# Altium schematic sheet P1.schdoc
size 839 x 594 mm; Symbol: Drawing-Symbol_A4; Company: 嘉立创EDA; Version: V1.0; Page Size: A4; @Project Name: Matrix_PassThrough; @Update Date: 2026-05-08; @Create Date: 2026-05-08; Device: Drawing-Symbol_A4; @Board Name: Board1; @Page Name: P1; @Create Time: 22:34:33; @Page Count: 1; @Page No: 1; @Schematic Name: Schematic1; @Update Time: 22:34:33; @Assembly Variant: Basic; Border: 1; Title Block Position: 3; Size: A4; Width: 3304; Height: 2338; Region Start: 1; X Region Count: 6; Y Region Count: 4; Blade Width: 10; Title Block: 1
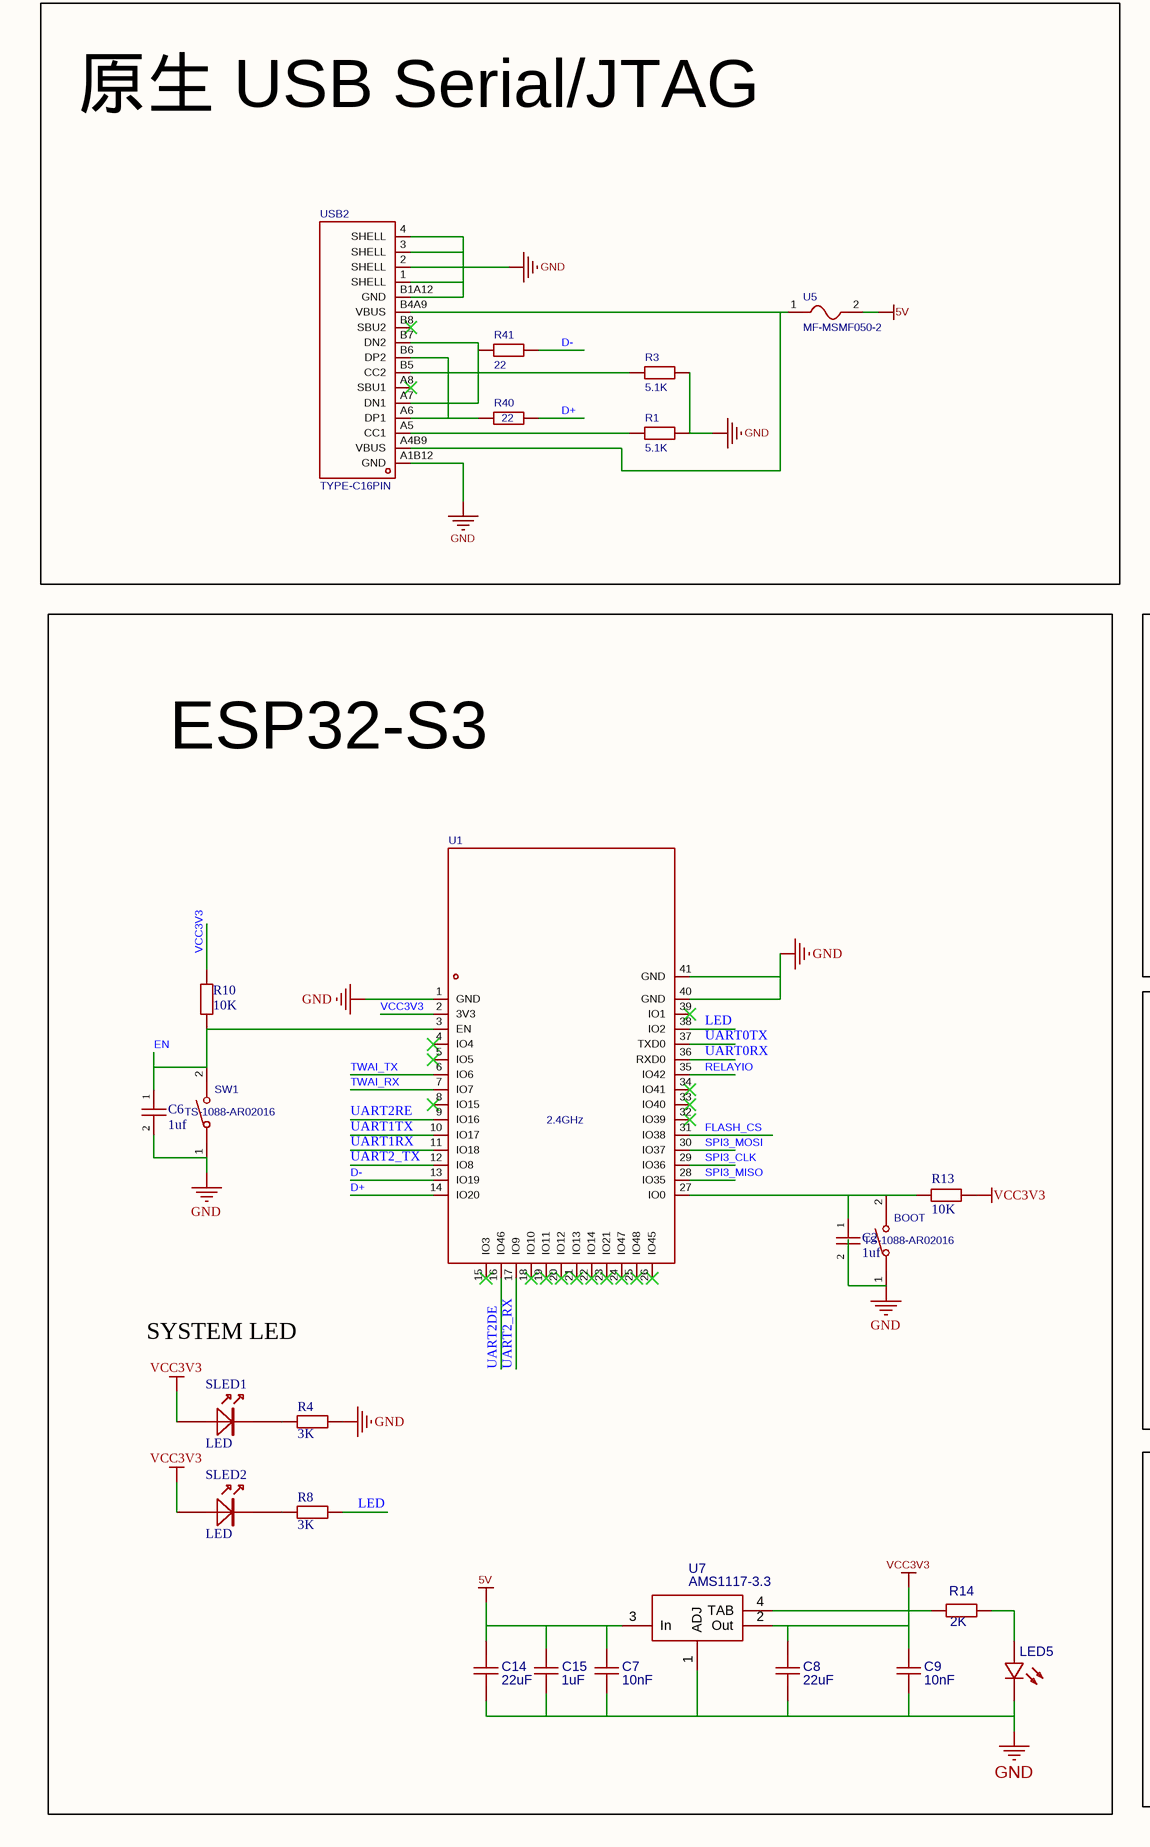
[diagram p0: P1.schdoc, left]
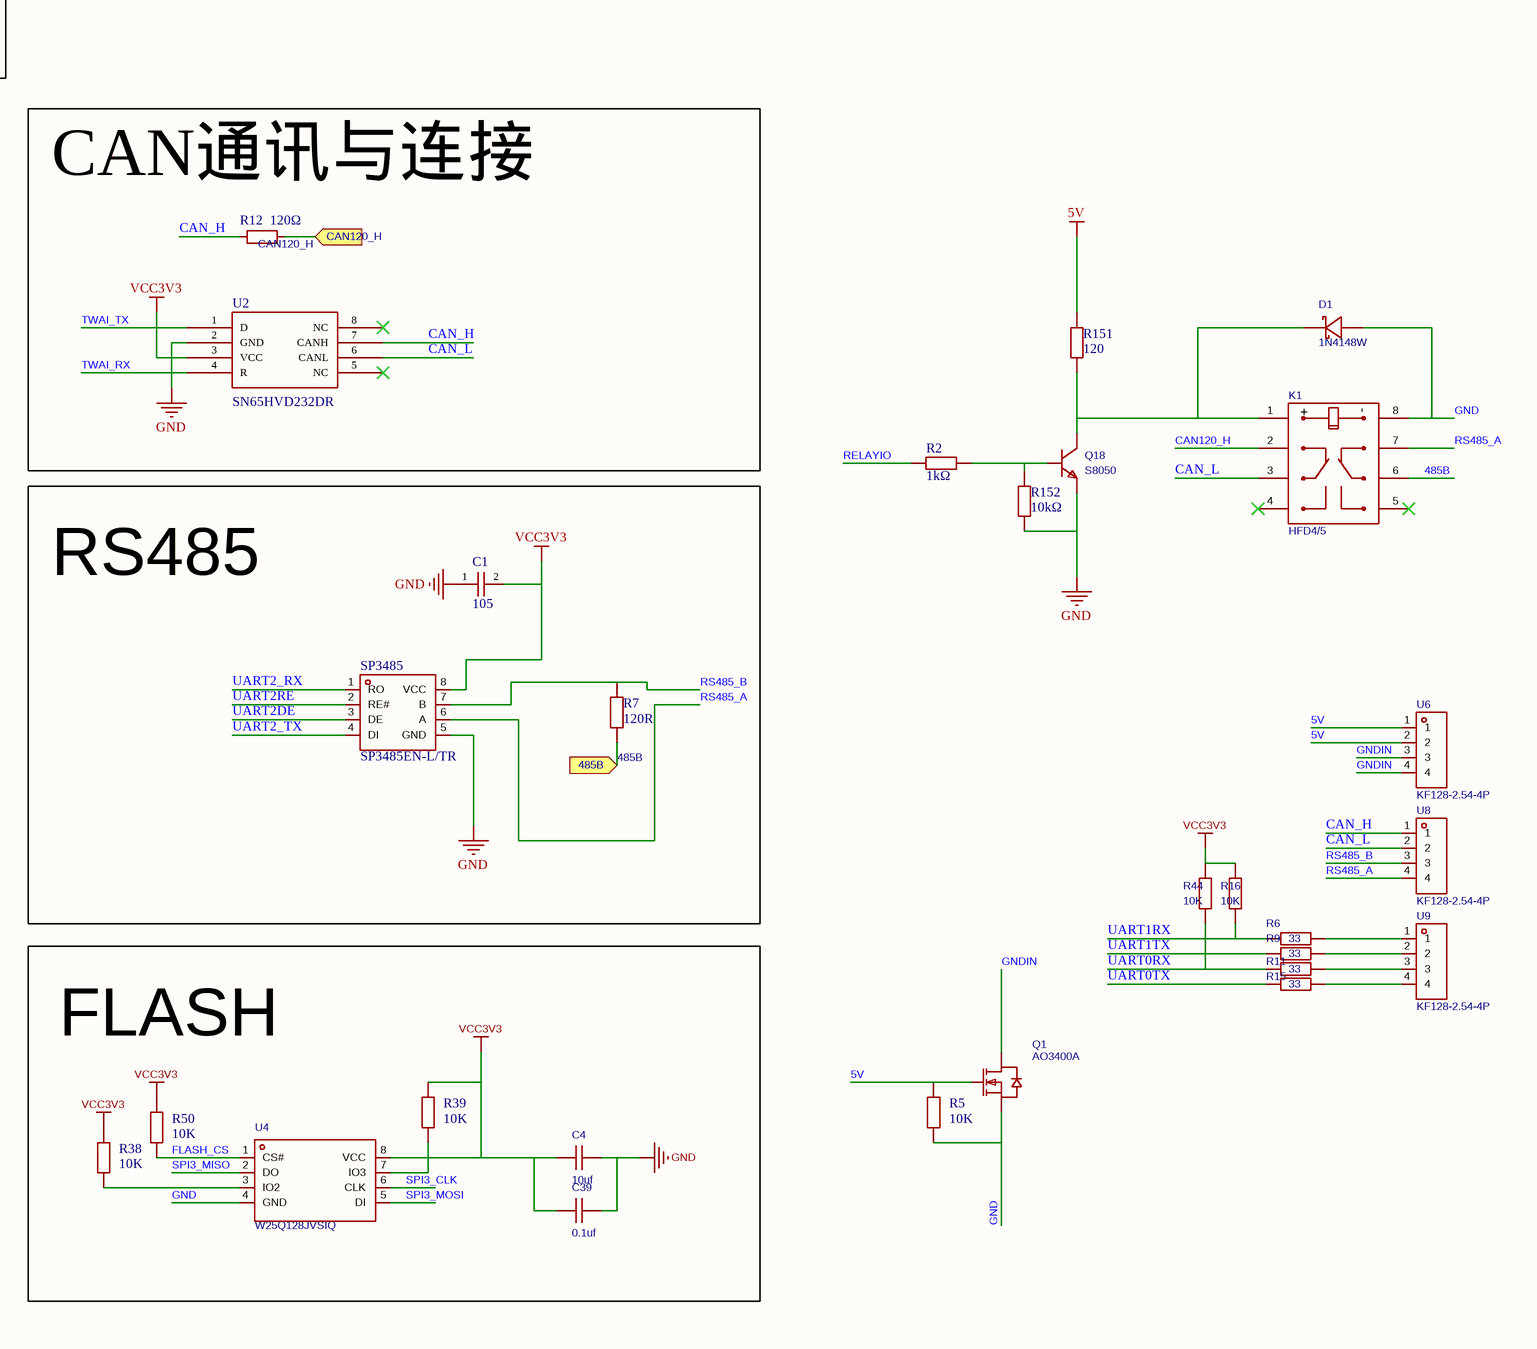
[diagram p1: P1.schdoc, right]

## Parts
BOOT  TS-1088-AR02016  [SW-SMD_L3.9-W3.0-P4.45]
C1  105  [0805_107]
C2  1uf  [0805R_107]
C4  10uf  [C0805]
C6  1uf  [0805R_107]
C7  10nF  [C0603]
C8  22uF  [22uFC1206]
C9  10nF  [C0603]
C14  22uF  [22uFC1206]
C15  1uF  [C0603]
C39  0.1uf  [C0805]
D1  1N4148W  [SOD-123_L2.7-W1.6-LS3.7-FD]
K1  HFD4/5  [RELAY-TH_HFDXXX]
LED5  FC-DA1608HRK-620D  [LED0805-FD_GL0805UG01]  (value not drawn)
Q1  AO3400A  [SOT-23-3_L2.9-W1.3-P1.90-LS2.4-BR]
Q18  S8050  [SOT-23-3_L2.9-W1.6-P1.90-LS2.8-BR]
R1  5.1K  [R0603]
R2  1kΩ  [R0805]
R3  5.1K  [R0603]
R4  3K  [0805_107]
R5  10K  [0805_107]
R6  33  [R0603]
R7  120R  [0805_107]
R8  3K  [0805_107]
R9  33  [R0603]
R10  10K  [0805_107]
R11  33  [R0603]
R12  120Ω  [R0805]
R13  10K  [0805_107]
R14  2K  [R0603]
R15  33  [R0603]
R16  10K  [R0603]
R38  10K  [0805_107]
R39  10K  [0805_107]
R40  22  [R0603]
R41  22  [R0603]
R44  10K  [R0603]
R50  10K  [0805_107]
R151  120  [R0805]
R152  10kΩ  [R0805]
SLED1  LED  [LED0805-RD_GREEN-1]
SLED2  LED  [LED0805-RD_GREEN-1]
SP3485  SP3485EN-L/TR  [SO-8_L4.9-W3.9-P1.27-LS6.0-BL]
SW1  TS-1088-AR02016  [SW-SMD_L3.9-W3.0-P4.45]
U1  2.4GHz  [WIRELM-SMD_ESP32-S3-WROOM-1]
U2  Manufacturer Part Number: SN65HVD232DR  [SO-8]  (hidden comment: SN65HVD232D)
U4  W25Q128JVSIQ  [SOIC-8_L5.3-W5.3-P1.27-LS8.0-BL]
U5  MF-MSMF050-2  [F1812]
U6  KF128-2.54-4P  [CONN-TH_4P-P2.54_KF128-2.54-4P]
U7  AMS1117-3.3  [ams1117]
U8  KF128-2.54-4P  [CONN-TH_4P-P2.54_KF128-2.54-4P]
U9  KF128-2.54-4P  [CONN-TH_4P-P2.54_KF128-2.54-4P]
USB2  TYPE-C16PIN  [USB-C-SMD_TYPE-C16PIN]

## Blocks framed on the sheet
原生 USB Serial/JTAG: R1 R3 R40 R41 U5 USB2
ESP32-S3: BOOT C2 C6-C9 C14 C15 LED5 R4 R8 R10 R13 R14 SLED1 SLED2 SW1 U1 U7
CAN通讯与连接: R12 U2
RS485: C1 R7 SP3485
FLASH: C4 C39 R38 R39 R50 U4

## Ports
485B (in), CAN120_H (in)

## Nets
5V: C7.2 C14.2 C15.2 Q1.1(G) R5.2 R151.2 U5.2 U6.1 U6.2 U7.3(In)
GND: BOOT.1 C1.1 C2.2 C4.2 C6.2 C7.1 C8.1 C9.1 C14.1 C15.1 C39.2 D1.1(A) K1.8 LED5.2(K) Q1.2(S) Q18.2 R1.2 R3.2 R4.2 R5.1 R152.1 SP3485.5(GND) SW1.1 U1.1(GND) U1.40(GND) U1.41(GND) U2.2(GND) U4.4(GND) U7.1(ADJ) USB2.1(SHELL) USB2.2(SHELL) USB2.3(SHELL) USB2.4(SHELL) USB2.A1B12(GND) USB2.B1A12(GND)
VCC3V3: C1.2 C4.1 C8.2 C9.2 C39.1 R10.2 R13.1 R14.1 R16.2 R38.2 R39.2 R44.2 R50.2 SLED1.1 SLED2.1 SP3485.8(VCC) U1.2(3V3) U2.3(VCC) U4.8(VCC) U7.2(Out) U7.4(TAB)
485B: K1.6 R7.1 ; port 485B
CAN120_H: K1.2 R12.2 ; port CAN120_H
CAN_H: R12.1 U2.7(CANH) U8.1
CAN_L: K1.3 U2.6(CANL) U8.2
D+: R40.2 U1.14(IO20)
D-: R41.2 U1.13(IO19)
EN: C6.1 R10.1 SW1.2 U1.3(EN)
FLASH_CS: R50.1 U1.31(IO38) U4.1(CS#)
GNDIN: Q1.3(D) U6.3 U6.4
LED: R8.2 U1.38(IO2)
RELAYIO: R2.1 U1.35(IO42)
RS485_A: K1.7 SP3485.6(A) U8.4
RS485_B: R7.2 SP3485.7(B) U8.3
SPI3_CLK: U1.29(IO36) U4.6(CLK)
SPI3_MISO: U1.28(IO35) U4.2(DO)
SPI3_MOSI: U1.30(IO37) U4.5(DI)
TWAI_RX: U1.7(IO7) U2.4(R)
TWAI_TX: U1.6(IO6) U2.1(D)
UART0RX: R11.2 R44.1 U1.36(RXD0)
UART0TX: R15.2 U1.37(TXD0)
UART1RX: R6.2 R16.1 U1.11(IO18)
UART1TX: R9.2 U1.10(IO17)
UART2_RX: SP3485.1(RO) U1.17(IO9)
UART2_TX: SP3485.4(DI) U1.12(IO8)
UART2DE: SP3485.3(DE) U1.16(IO46)
UART2RE: SP3485.2(RE#) U1.9(IO16)
NetBOOT_2: BOOT.2 C2.1 R13.2 U1.27(IO0)
NetD1_2: D1.2(K) K1.1 Q18.3 R151.1
NetLED5_1: LED5.1(A) R14.2
NetQ18_1: Q18.1 R2.2 R152.2
NetR1_1: R1.1 USB2.A5(CC1)
NetR3_1: R3.1 USB2.B5(CC2)
NetR4_1: R4.1 SLED1.2
NetR6_1: R6.1 U9.1
NetR8_1: R8.1 SLED2.2
NetR9_1: R9.1 U9.2
NetR11_1: R11.1 U9.3
NetR15_1: R15.1 U9.4
NetR38_1: R38.1 U4.3(IO2)
NetR39_1: R39.1 U4.7(IO3)
NetR40_1: R40.1 USB2.A6(DP1) USB2.B6(DP2)
NetR41_1: R41.1 USB2.A7(DN1) USB2.B7(DN2)
NetU5_1: U5.1 USB2.A4B9(VBUS) USB2.B4A9(VBUS)

Not connected (* = marked no-connect by the designer): K1 4* 5*; U1 4(IO4)* 5(IO5)* 8(IO15)* 15(IO3)* 18(IO10)* 19(IO11)* 20(IO12)* 21(IO13)* 22(IO14)* 23(IO21)* 24(IO47)* 25(IO48)* 26(IO45)* 32(IO39)* 33(IO40)* 34(IO41)* 39(IO1)*; U2 5(NC)* 8(NC)*; USB2 A8(SBU1)* B8(SBU2)*

## Notes on the sheet
- SYSTEM LED
- 创建日期
- 2026-05-08
- 原理图
- 板子
- Schematic1
- Board1
- 更新日期
- 图页
- P1
- 绘制
- 审阅
- Matrix_PassThrough
- 版本
- V1.0
- 尺寸
- A4
- 页    1    共    1
- 嘉立创EDA
- (in symbol HFD4/5) +; -

## Library data of the parts
BOOT SW1 = TS-1088-AR02016: 电路结构:单刀单掷;按钮形状:圆形按钮;作用力:1.6N;安装方式:立贴;开关长度:4mm;开关宽度:3mm;开关高度:2mm;带支架:不带支架;触点电流:50mA;额定电压:12V;工作寿命:10万次;; Manufacturer: XUNPU(讯普); 3D Model: b26698b69f274ffabef8a26c7d0e5dd10819f05c4eef4c71ace90d822a990e87; 3D Model Transform: 188.976,114.174,0,0,0,0,0,0,0; Circuit: 单刀单掷; Actuator Style: 圆形按钮; Operating Force: 1.6N; Switch Height: 2mm; with Bracket: 不带支架; Contact Current: 50mA; Voltage Rating: 12V; Actuator/Cap Color: 黑色; Life: 10万次; AddInBom: yes; ModelName: SW-SMD_L3.9-W2.9-H2.0-LS4.8; Symbol: TS-1088-AR02016; Device: TS-1088-AR02016; LCSC Part Name: 4*3*2mm 立贴 轻触开关; Supplier Part: C720477; Manufacturer Part: TS-1088-AR02016; Supplier Footprint: SMD,4x3mm; JLCPCB Part Class: Basic Part; Datasheet: https://item.szlcsc.com/datasheet/TS-1088-AR02016/763484.html; Supplier: LCSC; Mounting Type: 立贴; Length: 4mm; Width: 3mm; Termination Style: SMD接片; Operating Temperature: -30℃~+80℃; ConvertToPcb: yes; FootprintName: SW-SMD_L3.9-W3.0-P4.45
C1 = 105: Capacitor; Symbol: Cap; Origin Footprint: C 1210_L; Value: 104; AddInBom: yes; Device: 105; Design Item ID: Cap; Library Name: Matrix_Schlib; Published: 8-Jun-2000; LatestRevisionDate: 17-Jul-2002; LatestRevisionNote: Re-released for DXP Platform.; Publisher: Altium Limited; ConvertToPcb: yes
C2 C6 = 104: Capacitor; Symbol: Cap; Origin Footprint: C_0805; Value: 104; AddInBom: yes; Device: 104; Design Item ID: Cap; Library Name: Matrix_Schlib; Published: 8-Jun-2000; LatestRevisionDate: 17-Jul-2002; LatestRevisionNote: Re-released for DXP Platform.; Publisher: Altium Limited; ConvertToPcb: yes
C4 C39 = CL21B103KBANNNC: 容值:10nF;精度:±10%;额定电压:50V;温度系数:X7R;; Manufacturer: SAMSUNG(三星); 3D Model: 1ba041120af144c991958decab20d2410819f05c4eef4c71ace90d822a990e87; 3D Model Transform: 78.74,51.181,0,0,0,0,0,0.0005,0; Tolerance: ±10%; Voltage Rating: 50V; Temperature Coefficient: X7R; AddInBom: yes; ModelName: C0805_L2.0-W1.3-H1.3; Symbol: CL21B103KBANNNC; Device: CL21B103KBANNNC; LCSC Part Name: 10nF ±10% 50V; Manufacturer Part: CL21B103KBANNNC; Supplier Footprint: 0805; JLCPCB Part Class: Basic Part; Datasheet: https://item.szlcsc.com/datasheet/CL21B103KBANNNC/2062.html; Supplier: LCSC; ConvertToPcb: yes; FootprintName: C0805
  C4: Value: 10uf
  C39: Value: 0.1uf
C7 C9 = CC0603KRX7R9BB103: Manufacturer: YAGEO; Add into BOM: yes; 3D Model: fca5be93b99f4b5a9a2fd372d58c31d9; Symbol: 10nF; Device: CC0603KRX7R9BB103; Convert to PCB: yes; Supplier: LCSC; Manufacturer Part: CC0603KRX7R9BB103; FootprintName: C0603; ModelName: C0603
C8 C14 = GRM21BD70J226ME44L: Manufacturer: Murata Electronics; Add into BOM: yes; Origin Footprint: CAP_0805; Symbol: 22uF; Device: GRM21BD70J226ME44L; Convert to PCB: yes; Supplier: LCSC; Manufacturer Part: GRM21BD70J226ME44L
C15 = CL10A105KP8NNNC: Manufacturer: SAMSUNG; Add into BOM: yes; 3D Model: fca5be93b99f4b5a9a2fd372d58c31d9; Symbol: 1uF; Device: CL10A105KP8NNNC; Convert to PCB: yes; Supplier: LCSC; Manufacturer Part: CL10A105KP8NNNC; FootprintName: C0603; ModelName: C0603
D1 = 1N4148W_C7420318: 二极管配置:独立式;正向压降(Vf):1.25V@150mA;直流反向耐压(Vr):100V;整流电流:150mA;反向恢复时间(Trr):4ns;; Manufacturer: R+O(宏嘉诚); AddInBom: yes; ModelId: 5054d9b7be8b429dad093a54b517b4dd0819f05c4eef4c71ace90d822a990e87; ModelTransform: 145.669,61.024,0,0,0,0,0,0,0; Diode Configuration: 独立式; Voltage - DC Reverse(Vr): 100V; Current - Rectified: 150mA; Pd - Power Dissipation: 400mW; Reverse Leakage Current (Ir): 1uA@75V; Reverse Recovery Time (trr): 4ns; Operating Junction Temperature Range: -55℃~+150℃; Non-Repetitive Peak Forward Surge Current: 2A; Symbol: 1N4148W_C7420318; Device: 1N4148W_C7420318; LCSC Part Name: 100V 150mA; SupplierPart: C7420318; ManufacturerPart: 1N4148W; Supplier Footprint: SOD-123; JLCPCB Part Class: Extended Part; Datasheet: https://item.szlcsc.com/datasheet/1N4148W/8397140.html; Supplier: LCSC; ConvertToPcb: yes; FootprintName: SOD-123_L2.7-W1.6-LS3.7-FD; ModelName: SOD-123_L2.7-W1.6-LS3.7-FD; Voltage - Forward(Vf@If): 1.25V@150mA
K1 = HFD4/5: 线圈电压:5V;触点形式:两组转换:2C(双刀双掷-转换);触点容量(电阻负载):1A@30VDC；300mA@125VAC;最大切换电压:250V@AC；220V@DC;最大切换电流:2A;; Manufacturer: HF(宏发); AddInBom: yes; ModelId: 1e57af8465474731bf198d1aa9ffbc580819f05c4eef4c71ace90d822a990e87; ModelName: RELAY-TH_L10.0-W6.5-H5.4; ModelTransform: 393.7,256.299,0,0,0,0,0,0,-137.795; Coil Voltage: 5V; Coil Rated Power: 140mW; Coil Resistance: 178Ω; Switching Current(Max): 2A; Operate Time: 3ms; Coil Type: 有极性-单线圈; Contact Resistance: 100mΩ; Symbol: HFD4/5; Device: HFD4/5; LCSC Part Name: 超小型5V继电器 双刀双掷; SupplierPart: C23510; ManufacturerPart: HFD4/5; Supplier Footprint: DIP,10x6.5mm; JLCPCB Part Class: Extended Part; Datasheet: https://item.szlcsc.com/datasheet/HFD4%252F5/24246.html; Supplier: LCSC; ConvertToPcb: yes; FootprintName: RELAY-TH_HFDXXX; Contact Form: 两组转换:2C(双刀双掷-转换); Number of Pins: 8; Contact Rating: 1A@30VDC；300mA@125VAC; Switching Voltage(Max): 250V@AC；220V@DC; Contact Material: AgNi+镀金; Release Time: 3ms; Operating Temperature: -40℃~+85℃
LED5 = FC-DA1608HRK-620D: Manufacturer: NATIONSTAR; Add into BOM: yes; Symbol: FC-DA1608HRK-620D; Device: FC-DA1608HRK-620D; Convert to PCB: yes; Supplier: LCSC; Manufacturer Part: FC-DA1608HRK-620D; Origin Footprint: LED-0603
Q1 = AO3400A_C347475: 数量:1个N沟道;漏源电压(Vdss):30V;连续漏极电流(Id):5.8A;导通电阻(RDS(on)):17mΩ@10V;耗散功率(Pd):1.4W;阈值电压(Vgs(th)):1.1V@250uA;; Manufacturer: UMW(友台半导体); AddInBom: yes; ModelId: c62791f0466c4ae2a892c056b845b0ca0819f05c4eef4c71ace90d822a990e87; ModelName: SOT-23-3P_L2.9-W1.3-H1.0-LS2.4-P0.95; ModelTransform: 98.425,114.173,0,180,0,0,0.0005,-0.0005,0; Number: 1个N沟道; Drain to Source Voltage: 30V; Current - Continuous Drain(Id): 5.8A; Pd - Power Dissipation: 1.4W; Gate Charge(Qg): 9.7nC@4.5V; Input Capacitance(Ciss): 823pF; Reverse Transfer Capacitance (Crss@Vds): 77pF; Output Capacitance(Coss): 99pF; Symbol: AO3400A_C347475; Device: AO3400A_C347475; LCSC Part Name: 1个N沟道 耐压:30V 电流:5.8A; SupplierPart: C347475; ManufacturerPart: AO3400A; Supplier Footprint: SOT-23; JLCPCB Part Class: Extended Part; Datasheet: https://item.szlcsc.com/datasheet/AO3400A/324135.html; Supplier: LCSC; ConvertToPcb: yes; FootprintName: SOT-23-3_L2.9-W1.3-P1.90-LS2.4-BR; RDS(on): 17mΩ@10V; Gate Threshold Voltage (Vgs(th)): 1.1V@250uA; Operating Temperature: -55℃~+150℃
Q18 = S8050_C105433: 晶体管类型:NPN;集射极击穿电压(Vceo):25V;集电极电流(Ic):500mA;功率(Pd):300mW;直流电流增益(hFE@Ic,Vce):120@50mA,1V;; Manufacturer: CJ(江苏长电/长晶); 3D Model: 89cb27a44ab2466697082bb9fd73a7d0; 3D Model Transform: 110.236,114.173,0,180,0,0,-0.005,0.0005,0; Transistor Type: NPN; Collector-Emitter Breakdown Voltage (Vceo): 25V; Collector Current (Ic): 500mA; Power Dissipation (Pd): 300mW; Collector Cut-Off Current (Icbo): 100nA; Collector-Emitter Saturation Voltage (VCE(sat)@Ic,Ib): 600mV@500mA,50mA; Transition Frequency (fT): 150MHz; AddInBom: yes; ModelName: SOT-23-3L_L2.9-W1.6-H1.1-LS2.8-P0.95; Symbol: S8050_C105433; Device: S8050_C105433; LCSC Part Name: NPN 25V 500mA L档 120-200; Manufacturer Part: S8050; Supplier Footprint: SOT-23; JLCPCB Part Class: Extended Part; Datasheet: https://atta.szlcsc.com/upload/public/pdf/source/20170415/1492237762328.pdf; Supplier: LCSC; DC Current Gain (hFE@Ic,Vce): 120@50mA,1V; Operating Temperature: +150℃@(Tj); ConvertToPcb: yes; FootprintName: SOT-23-3_L2.9-W1.6-P1.90-LS2.8-BR
R1 R3 R6 R9 R11 R15 R16 R40 R41 R44 = Res_0603: Symbol: 电阻; 3D Model: fc143cca1e79419f9cd78b61e9279f080819f05c4eef4c71ace90d822a990e87; 3D Model Transform: 31.8897,63.7794,0,90,0,0,0,0,0; ConvertToPcb: yes; Device: Res_0603; Supplier Footprint: 0603; AddInBom: yes; FootprintName: R0603; ModelName: R0603
  R1 R3: Value: 5.1K
  R6 R9 R11 R15: Value: 33
  R16 R44: Value: 10K
  R40 R41: Value: 22
R2 = 0805W8F1001T5E: 电阻类型:厚膜电阻;阻值:1kΩ;精度:±1%;功率:125mW;; Manufacturer: UNI-ROYAL(厚声); Symbol: res2; Origin Footprint: C_0805; 3D Model: 37a81e68749a4138bd2dfa6897b24b85; 3D Model Transform: 78.74,51.181,0,0,0,0,0,-0.0005,0; Tolerance: ±1%; Power(Watts): 125mW; Temperature Coefficient: ±100ppm/℃; Overload Voltage (Max): 150V; AddInBom: yes; ModelName: R0805_L2.0-W1.3-H0.6; Device: 0805W8F1001T5E; Design Item ID: Res2; Library Name: Ultrapure100-PCB_1; Published: 8-Jun-2000; LatestRevisionDate: 17-Jul-2002; LatestRevisionNote: Re-released for DXP Platform.; Publisher: Altium Limited; LCSC Part Name: 1kΩ ±1% 125mW; Supplier Part: C17513; Manufacturer Part: 0805W8F1001T5E; Supplier Footprint: 0805; JLCPCB Part Class: Basic Part; Datasheet: https://atta.szlcsc.com/upload/public/pdf/source/20200306/C422600_1E6D84923E4A46A82E41ADD87F860B5C.pdf; Supplier: LCSC; Type: 厚膜电阻; Value: 1kΩ; Operating Temperature Range: -55℃~+155℃; ConvertToPcb: yes; FootprintName: R0805
R4 R8 = 510R: Resistor; Symbol: Res2; Origin Footprint: C_0805; AddInBom: yes; Device: 510R; Design Item ID: Res2; Library Name: Matrix_Schlib; Published: 8-Jun-2000; LatestRevisionDate: 17-Jul-2002; LatestRevisionNote: Re-released for DXP Platform.; Publisher: Altium Limited; ConvertToPcb: yes
R5 R7 R10 R13 R38 R39 R50 = 120R: Resistor; Symbol: Res2; Origin Footprint: C_0805; AddInBom: yes; Device: 120R; Design Item ID: Res2; Library Name: Matrix_Schlib; Published: 8-Jun-2000; LatestRevisionDate: 17-Jul-2002; LatestRevisionNote: Re-released for DXP Platform.; Publisher: Altium Limited; ConvertToPcb: yes
R12 = FRC0805J121 TS: 电阻类型:厚膜电阻;阻值:120Ω;精度:±5%;功率:125mW;工作电压:150V;温度系数:±100ppm/℃;; Manufacturer: FOJAN(富捷); Symbol: 电阻-0402; 3D Model: 37a81e68749a4138bd2dfa6897b24b85; 3D Model Transform: 78.74,51.181,0,0,0,0,0,-0.0005,0; Tolerance: ±5%; Power(Watts): 125mW; Voltage-Supply(Max): 150V; AddInBom: yes; ModelName: R0805_L2.0-W1.3-H0.6; Device: FRC0805J121 TS; Value: 120Ω; LCSC Part Name: 120Ω ±5% 125mW 厚膜电阻; Supplier Part: C3013232; Manufacturer Part: FRC0805J121 TS; Supplier Footprint: 0805; JLCPCB Part Class: Extended Part; Supplier: LCSC; Type: 厚膜电阻; Temperature Coefficient: ±100ppm/℃; Operating Temperature: -55℃~+155℃; ConvertToPcb: yes; FootprintName: R0805
R14 = RC0603FR-07470RL: Manufacturer: YAGEO; Symbol: 470; Add into BOM: yes; 3D Model: fc143cca1e79419f9cd78b61e9279f08; Device: RC0603FR-07470RL; Convert to PCB: yes; Supplier: LCSC; Manufacturer Part: RC0603FR-07470RL; FootprintName: R0603; ModelName: R0603
R151 = 0805W8F3000T5E: 电阻类型:厚膜电阻;阻值:300Ω;精度:±1%;功率:125mW;; Manufacturer: UNI-ROYAL(厚声); Symbol: res2; Origin Footprint: C_0805; 3D Model: 37a81e68749a4138bd2dfa6897b24b85; 3D Model Transform: 78.74,51.181,0,0,0,0,0,-0.0005,0; Tolerance: ±1%; Power(Watts): 125mW; Temperature Coefficient: ±100ppm/℃; Overload Voltage (Max): 150V; AddInBom: yes; ModelName: R0805_L2.0-W1.3-H0.6; Device: 0805W8F3000T5E; Value: 120; Design Item ID: Res2; Library Name: Ultrapure100-PCB_1; Published: 8-Jun-2000; LatestRevisionDate: 17-Jul-2002; LatestRevisionNote: Re-released for DXP Platform.; Publisher: Altium Limited; LCSC Part Name: 300Ω ±1% 125mW; Manufacturer Part: 0805W8F3000T5E; Supplier Footprint: 0805; JLCPCB Part Class: Basic Part; Datasheet: https://atta.szlcsc.com/upload/public/pdf/source/20200306/C422600_1E6D84923E4A46A82E41ADD87F860B5C.pdf; Supplier: LCSC; Type: 厚膜电阻; Operating Temperature Range: -55℃~+155℃; ConvertToPcb: yes; FootprintName: R0805
R152 = 0805W8F1002T5E_C17414: 电阻类型:厚膜电阻;阻值:10kΩ;精度:±1%;功率:125mW;; Manufacturer: UNI-ROYAL(厚声); Symbol: res2; Origin Footprint: C_0805; 3D Model: 37a81e68749a4138bd2dfa6897b24b85; 3D Model Transform: 78.74,51.181,0,0,0,0,0,-0.0005,0; Tolerance: ±1%; Power(Watts): 125mW; Temperature Coefficient: ±100ppm/℃; Overload Voltage (Max): 150V; AddInBom: yes; ModelName: R0805_L2.0-W1.3-H0.6; Device: 0805W8F1002T5E_C17414; Design Item ID: Res2; Library Name: Ultrapure100-PCB_1; Published: 8-Jun-2000; LatestRevisionDate: 17-Jul-2002; LatestRevisionNote: Re-released for DXP Platform.; Publisher: Altium Limited; LCSC Part Name: 10kΩ ±1% 125mW; Supplier Part: C17414; Manufacturer Part: 0805W8F1002T5E; Supplier Footprint: 0805; JLCPCB Part Class: Basic Part; Datasheet: https://atta.szlcsc.com/upload/public/pdf/source/20200306/C422600_1E6D84923E4A46A82E41ADD87F860B5C.pdf; Supplier: LCSC; Type: 厚膜电阻; Value: 10kΩ; Operating Temperature Range: -55℃~+155℃; ConvertToPcb: yes; FootprintName: R0805
SLED1 SLED2 = LED: Origin Footprint 1: C_0805; Origin Footprint 2: LED 0805G; AddInBom: yes; Symbol: LED; Device: LED; Design Item ID: LED; Library Name: STM32F103C8T6; ConvertToPcb: yes
SP3485 = SP3485EN-L/TR_C41365340: 类型:收发器;数据速率:14Mbps;; Manufacturer: ElecSuper(静芯微); Add into BOM: yes; 3D Model: 50ce3402a2354e6c8e8bd1c9ad02453e; 3D Model Transform: 192.913,236.22,0,0,0,0,0,0,0; Types: 收发器; Data Rate: 14Mbps; Supply Voltage: 3V~5.5V; Number of Driver: 1; Node Number: 256; ESD Protect: ±15kV; Symbol: SP3485EN-L/TR_C41365340; Device: SP3485EN-L/TR_C41365340; Convert to PCB: yes; LCSC Part Name: RS-485/RS422收发器; Supplier Part: C41365340; Manufacturer Part: SP3485EN-L/TR; Supplier Footprint: SOP-8; JLCPCB Part Class: Extended Part; Datasheet: https://atta.szlcsc.com/upload/public/pdf/source/20240821/A459ACE5F7B9AB6876164D8628816548.pdf; Supplier: LCSC; Number of receiver: 1; Operating Temperature: -40℃~+125℃; FootprintName: SO-8_L4.9-W3.9-P1.27-LS6.0-BL; ModelName: SO-8_L4.9-W3.9-P1.27-LS6.0-BL
U1 = ESP32-S3-WROOM-1-N16R8: 核心芯片:ESP32-S3R8;频率:2.4GHz;天线形式:板载PCB天线;发射功率:20.5dBm;接收灵敏度:-103.5dBm;; Manufacturer: ESPRESSIF(乐鑫); Symbol: ESP32-S3-WROOM-1(N16R8); 3D Model: 481f5bdfc076422c9bb3c23c3ada9c170819f05c4eef4c71ace90d822a990e87; 3D Model Transform: 708.73866,1003.97437,0,0,0,0,0,143.7,0; Interface Type: I2C；GPIO；UART；SPI；USB；I2S; Voltage - Supply: 3V~3.6V; Receive  Current: 95mA; Send  Current: 355mA; AddInBom: yes; Device: ESP32-S3-WROOM-1-N16R8; LCSC Part Name: 不带固件 通用型Wi-Fi+低功耗蓝牙MCU模组; Supplier Part: C2913202; Manufacturer Part: ESP32-S3-WROOM-1-N16R8; Supplier Footprint: SMD,25.5x18mm; JLCPCB Part Class: Extended Part; Datasheet: https://item.szlcsc.com/datasheet/ESP32-S3-WROOM-1-N16R8/3198300.html; Supplier: LCSC; Utilized IC / Part: ESP32-S3R8; Value: 2.4GHz; Antenna Type: 板载PCB天线; Output Power: 20.5dBm; Sensitivity: -103.5dBm; Operating Temperature: -40℃~+65℃; ConvertToPcb: yes; FootprintName: WIRELM-SMD_ESP32-S3-WROOM-1; ModelName: WIRELM-SMD_ESP32-S3-WROOM-1
U2 = SN65HVD232D: Manufacturer: Texas Instruments; Protocol: CAN; Number of Drivers/Receivers: 1/1; Duplex: Half; Data Rate: 1Mbps; Voltage - Supply: 3 V ~ 3.6 V; AddInBom: yes; Symbol: SN65HVD232D; Device: SN65HVD232D; Origin Footprint: SO-8; Design Item ID: SN65HVD232D; Library Name: MyPcbLib; Supplier 1: Digi-Key; Supplier Part Number 1: 296-26344-2-ND; RoHS: RoHS Compliant; Category: Integrated Circuits (ICs); Stock: 5000; Pricing 1: 2500=0.84375 (USD); Packaging: Tape amp; Reel (TR); Part Status: Active; Type: Transceiver; Operating Temperature: -40°C ~ 85°C; Mounting Type: Surface Mount; Package / Case: 8-SOIC (0.154quot;, 3.90mm Width); Supplier Device Package: 8-SOIC; ComponentLink1URL: http://www.ti.com/lit/ds/symlink/sn65hvd230.pdf; ComponentLink1Description: http://www.ti.com/lit/ds/symlink/sn65hvd230.pdf; Supplier 2: Digi-Key; Supplier Part Number 2: 296-26344-1-ND; Pricing 2: 1=2.05, 10=1.842, 100=1.4809, 500=1.21668, 1000=1.00811 (USD); FootprintName: SO-8; ConvertToPcb: yes
U4 = W25Q128JVSIQ: 接口类型:SPI;存储容量:128Mbit;时钟频率(fc):133MHz;; Manufacturer: Winbond(华邦); Symbol: W25Q128JVSIQTR; 3D Model: f83d990ad74f400caf5ac920b77715080819f05c4eef4c71ace90d822a990e87; 3D Model Transform: 208.661,311.25654,0,0,0,0,-0.0005,0.0005,0; Interface: SPI; Clock Frequency: 133MHz; Voltage - Supply: 2.7V~3.6V; Standby Supply Current: 1uA; Program / Erase Cycles: 100000次; Page Programming Time (Tpp): 3ms; Block Erase Time(tBE): 120ms@(32KB); Data Retention - TDR (Year): 20年; AddInBom: yes; ModelName: SOIC-8_L5.3-W5.3-H1.9-LS7.9-P1.27; Device: W25Q128JVSIQ; LCSC Part Name: 编带 支持双路/四路SPI接口的3V、128Mbit 串行闪存; Supplier Part: C97521; Manufacturer Part: W25Q128JVSIQ; Supplier Footprint: SOIC-8-208mil; JLCPCB Part Class: Basic Part; Datasheet: https://item.szlcsc.com/datasheet/W25Q128JVSIQ/98729.html; Supplier: LCSC; Memory Size: 128Mbit; Operating Temperature: -40℃~+85℃; ConvertToPcb: yes; FootprintName: SOIC-8_L5.3-W5.3-P1.27-LS8.0-BL
U5 = MF-MSMF050-2: 耐压(Vmax):15V;最大电流(Imax):100A;保持电流(Ihold):500mA;跳闸电流(Itrip):1A;; Manufacturer: BOURNS; 3D Model: bca21e458c564d38b781621ca22e660b0819f05c4eef4c71ace90d822a990e87; 3D Model Transform: 177.165,125.984,0,0,0,0,0.0005,0,0; Voltage - Max: 15V; Current - Max: 100A; Hold Current: 500mA; Trip Current: 1A; Resistance - Initial (Ri) (Min): 150mΩ; Resistance - Post Trip (R1) (Max): 1Ω; AddInBom: yes; ModelName: F1812_L4.5-W3.2-H1.0; Symbol: MF-MSMF050-2; Device: MF-MSMF050-2; LCSC Part Name: 15V 500mA 1812自恢复; Supplier Part: C17313; Manufacturer Part: MF-MSMF050-2; Supplier Footprint: 1812; JLCPCB Part Class: Extended Part; Datasheet: https://item.szlcsc.com/datasheet/MF-MSMF050-2/17998.html; Supplier: LCSC; Time to Trip(Max): -; Operating Temperature: -40℃~+85℃; Length: 5.4mm; Width: 3.2mm; Height: -; Pitch: -; ConvertToPcb: yes; FootprintName: F1812
U6 U8 U9 = KF128-2.54-4P: 结构:1x4P;间距:2.54mm;颜色:绿色;安装方式:直插;排数:1;每排PIN数:4;额定电流:8A;额定电压:130V;线规 - AWG:18~26;线规 - 平方毫米:1;工作温度:-40℃~+105℃;; Manufacturer: KEFA(科发); AddInBom: yes; ModelId: 9f7a41ffaa5c44f2bf890988da2df6a50819f05c4eef4c71ace90d822a990e87; ModelTransform: 399.999,248.031,0,0,0,0,0,-5.906,-137.795; Number of Positions or Pins: 1x4P; Pitch: 2.54mm; Number of PINs Per Row: 4; Current Rating: 8A; Voltage Rating (Max): 130V; Wire Gauge - AWG: 18~26; Wire Gauge - mm2: 1; Symbol: KF128-2.54-4P; Device: KF128-2.54-4P; LCSC Part Name: 1x4P 2.54mm 直插 排数:1 每排P数:4; SupplierPart: C474922; ManufacturerPart: KF128-2.54-4P; Supplier Footprint: 插件,P=2.54mm; JLCPCB Part Class: Extended Part; Datasheet: https://item.szlcsc.com/datasheet/KF128-2.54-4P/481540.html; Supplier: LCSC; ConvertToPcb: yes; FootprintName: CONN-TH_4P-P2.54_KF128-2.54-4P; ModelName: CONN-TH_4P-P2.54_KF128-2.54-4P; Color: 绿色; Mounting Type: 直插; Number of Pins: 4P; Number of Rows: 1; Operating Temperature: -40℃~+105℃
U7 = AMS1117-3.3: Manufacturer: AMS; Add into BOM: yes; SMT Type: Extend; Origin Footprint: SOT-223; Symbol: AMS1117-3.3; Device: AMS1117-3.3; Convert to PCB: yes; Supplier: LCSC; Manufacturer Part: AMS1117-3.3; image: //image.lceda.cn/szlcsc/C6188.jpg
USB2 = TYPE-C16PIN: 连接器类型:Type-C;协议标准:-;公母:母;安装方式:卧贴;触点数量:16P;端口数量:1;额定电流 - 电源:3A;工作温度:-40℃~+85℃;; Manufacturer: SHOU HAN(首韩); 3D Model: d6783d3a2268456b863f42d3286191d00819f05c4eef4c71ace90d822a990e87; 3D Model Transform: 351.9678,311.023,0,180,0,0,0,-41.85,-39.37; Connector Type: Type-C; Gender: 母; Number of Contacts: 16P; Number of Ports: 1; Current Rating-Power: 3A; Voltage Rating: 30V; Connect-Disconnect Life: 1万次; Detection color: 黑色; AddInBom: yes; Symbol: TYPE-C16PIN; Device: TYPE-C16PIN; LCSC Part Name: 16P卧贴母座; Supplier Part: C393939; Manufacturer Part: TYPE-C16PIN; Supplier Footprint: SMD; JLCPCB Part Class: Extended Part; Datasheet: https://item.szlcsc.com/datasheet/TYPE-C16PIN/372551.html; Supplier: LCSC; Protocol Standard: -; Mounting Type: 卧贴; Supplementary Features: -; Center Height: -; Length: -; Operating Temperature: -40℃~+85℃; ConvertToPcb: yes; FootprintName: USB-C-SMD_TYPE-C16PIN; ModelName: USB-C-SMD_TYPE-C16PIN